# Altium schematic sheet TennisButler V1.0.SchDoc: Table of Contents
size 228 x 165 mm; DrawnBy: Joseph Riesen; Revision: 1.0; SheetNumber: 1
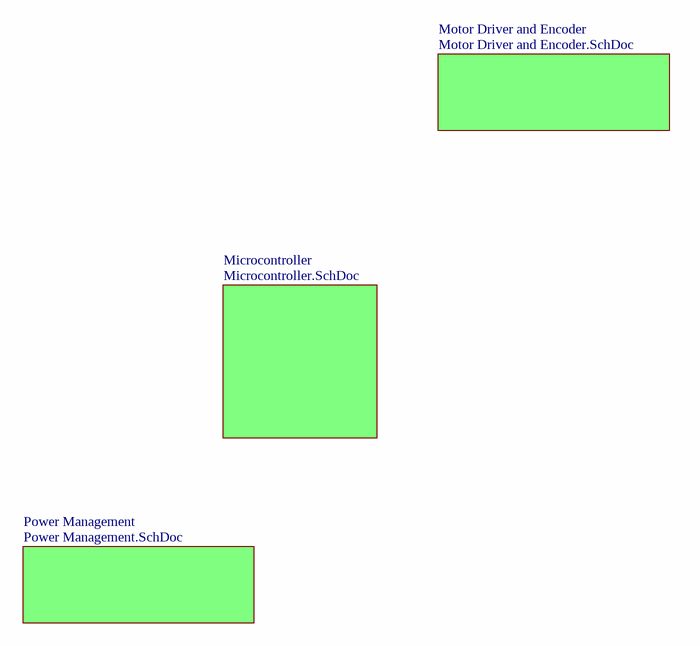
[diagram p0: TennisButler V1.0.SchDoc]

## Sub-sheets
Microcontroller = Microcontroller.SchDoc: no entries
Motor Driver and Encoder = Motor Driver and Encoder.SchDoc: no entries
Power Management = Power Management.SchDoc: no entries

## Notes on the sheet
- Title:
- Size:
- Letter
- Drawn By:
- Rev:
- Date:
- Time:
- Sheet
- /